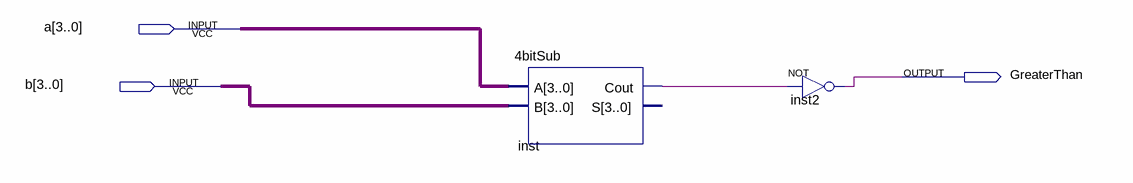
[diagram p0: schematic sheet]
// Quartus schematic comparator.bdf as structural Verilog: 2 symbols, 3 pins
module comparator (
  input  [3:0] a,
  input  [3:0] b,
  output GreaterThan
);

  wire inst_cout;

  \4bitSub  inst (.A(a), .B(b), .Cout(inst_cout));  // open: S
  not inst2 (GreaterThan, inst_cout);
endmodule
